# EAGLE design sharp_memory_breakout (EAGLE 6.4)
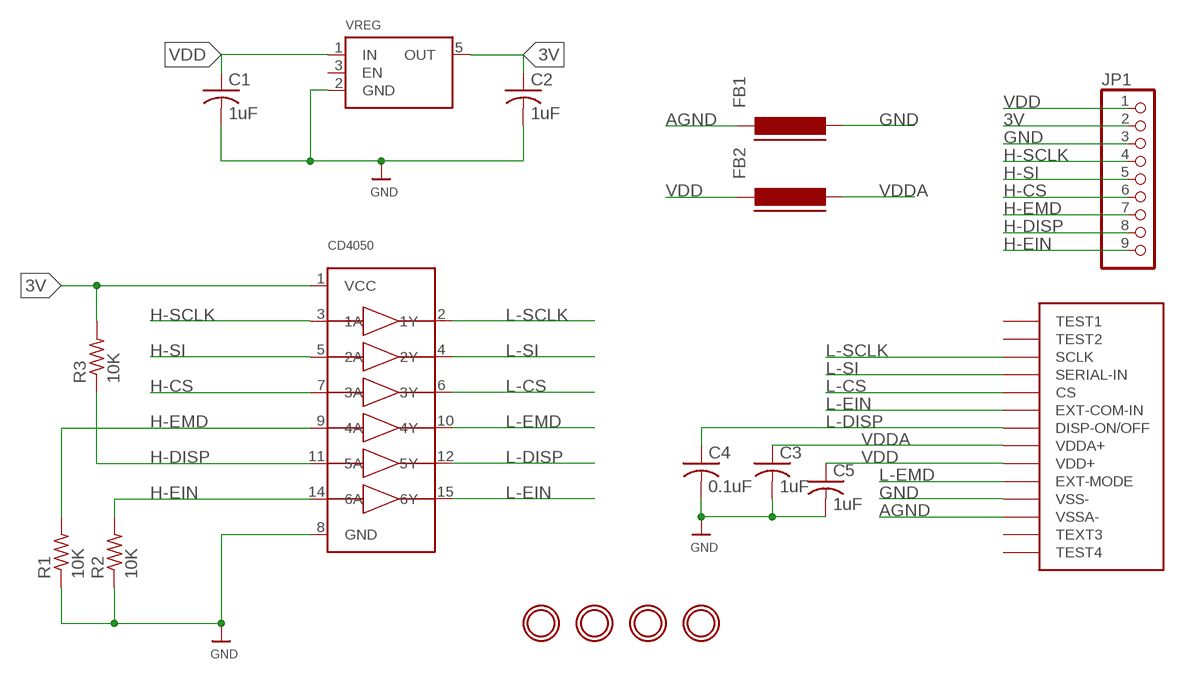
[diagram p0: schematic, sheet 1]

## Parts
C1  1uF  C-USC0805K  [C0805K]
C2  1uF  C-USC0805K  [C0805K]
C3  1uF  C-USC0805K  [C0805K]
C4  0.1uF  C-USC0805K  [C0805K]
C5  1uF  C-USC0805K  [C0805K]
CD4050  74HC4050D  [SOIC16]
FB1  FERRITE-0603  [FB603]
FB2  FERRITE-0603  [FB603]
JP1  PINHD-1X9  [1X09-BIG]
R1  10K  R-US_R0805  [R0805]
R2  10K  R-US_R0805  [R0805]
R3  10K  R-US_R0805  [R0805]
U$1  SHARP-MEMORY  [SHARP-MEMORY]
U$2  MOUNTINGHOLE3.0THIN  [MOUNTINGHOLE_3.0_PLATEDTHIN]
U$3  MOUNTINGHOLE3.0THIN  [MOUNTINGHOLE_3.0_PLATEDTHIN]
U$4  MOUNTINGHOLE3.0THIN  [MOUNTINGHOLE_3.0_PLATEDTHIN]
U$5  MOUNTINGHOLE3.0THIN  [MOUNTINGHOLE_3.0_PLATEDTHIN]
VREG  ADP121  [SOT23-5]

## Nets
3V: C2.1 CD4050.1(VCC) JP1.2 R3.2 VREG.5(OUT)
AGND: FB1.1 U$1.P$12(VSSA-)
GND: C1.2 C2.2 C3.2 C4.2 C5.2 CD4050.8(GND) FB1.2 JP1.3 R1.1 R2.1 U$1.P$11(VSS-) VREG.2(GND)
H-CS: CD4050.7(3A) JP1.6
H-DISP: CD4050.11(5A) JP1.8 R3.1
H-EIN: CD4050.14(6A) JP1.9 R2.2
H-EMD: CD4050.9(4A) JP1.7 R1.2
H-SCLK: CD4050.3(1A) JP1.4
H-SI: CD4050.5(2A) JP1.5
L-CS: CD4050.6(3Y) U$1.P$5(CS)
L-DISP: C4.1 CD4050.12(5Y) U$1.P$7(DISP-ON/OFF)
L-EIN: CD4050.15(6Y) U$1.P$6(EXT-COM-IN)
L-EMD: CD4050.10(4Y) U$1.P$10(EXT-MODE)
L-SCLK: CD4050.2(1Y) U$1.P$3(SCLK)
L-SI: CD4050.4(2Y) U$1.P$4(SERIAL-IN)
VDD: C1.1 C5.1 FB2.1 JP1.1 U$1.P$9(VDD+) VREG.1(IN)
VDDA: C3.1 FB2.2 U$1.P$8(VDDA+)
Unconnected: U$1.P$1(TEST1) U$1.P$2(TEST2) U$1.P$13(TEXT3) U$1.P$14(TEST4) VREG.3(EN)

## Library data of the parts
C1-C5 = adafruit:C-US: CAPACITOR, American symbol
CD4050 = microbuilder:74HC4050D: 6-channel level shifter 74HC4050D - 2V-6V Supply Digikey: 74HC4050D,653-ND Mouser: 771-74HC4050D-T
FB1 FB2 = dp_devices:FERRITE: Ferrite bead in various packages
JP1 = adafruit:PINHD-1X9: Pin header 1x10 0.1" spacing With round pins
R1-R3 = adafruit:R-US_: RESISTOR, American symbol
U$1 = sharp-memory:SHARP-MEMORY
U$2-U$5 = TL2575:MOUNTINGHOLE: Mounting Hole For #2 screws (0.086"/2.18mm width, 0.094"/2.4mm hole) use 2.5mm
VREG = microbuilder:ADP121: LDO Fixed Voltage Regulator 150mA The ADP121 voltage regulator is ideal for regulating battery or solar power due to it's very low foreward voltage drop (maximum 90mV at 150mA). Forward Voltage Dropout: 90mV at 150mA Input Voltage Range: 2.3V-5.5V Output Voltage Range: 1.2V-3.3V (depending on model) Digikey: 3.3V - ADP121-AUJZ33R7CT-ND Digikey: 3.0V - ADP121-AUJZ30R7CT-ND

## Board
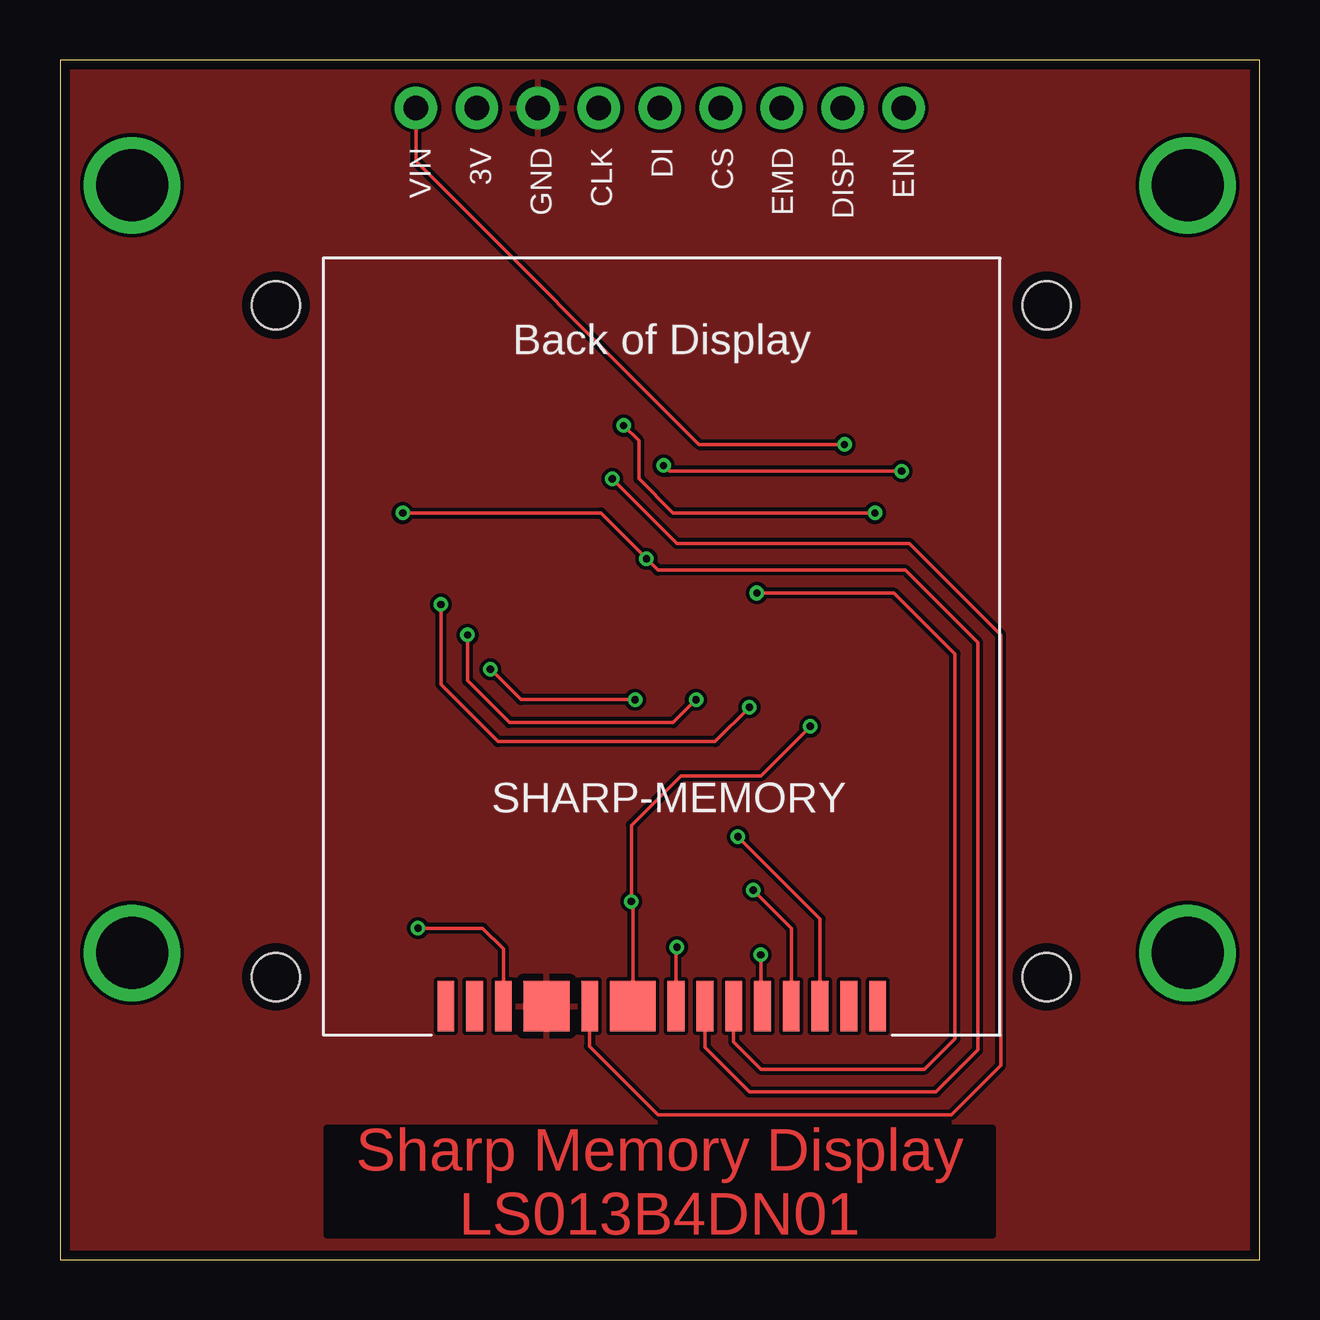
[diagram p1: board, top side]
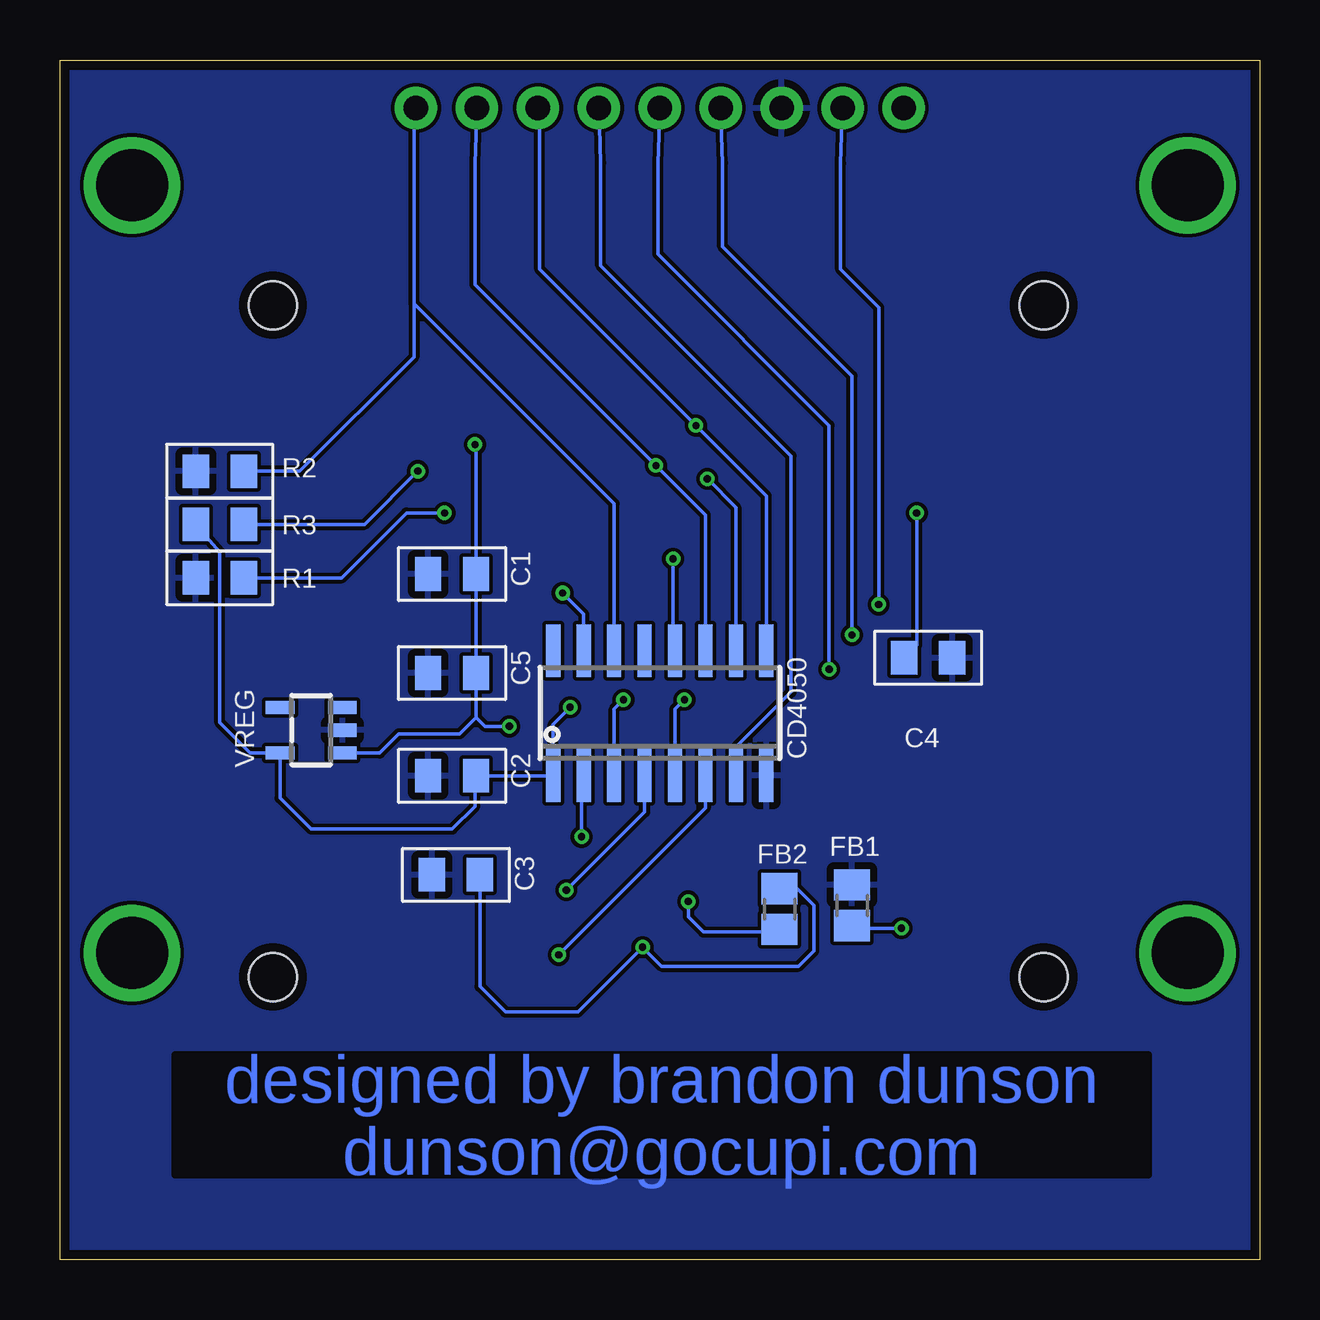
[diagram p2: board, bottom side, seen from below]

Size 50 x 50 mm. Coordinates in mm from the lower left corner, seen from the top.
Outline: 0,0 50,0 50,50 0,50 0,0
Copper layers (1*16): Top 0.035mm / dielectric 1.5mm / Bottom 0.035mm
Design rules "updated_SeeedStudio_2layer_DRU_no_angle_20140221": minimum track width 6mil, minimum drill 0.3mm, track to track 6mil, track to pad 6mil, pad to pad 6mil, via to via 6mil, smd to smd 0mil, copper to edge 0.4mm, drill to drill 6mil, minimum pad ring 10mil, minimum via ring 6mil, stop-mask expansion 2mil, vias tented up to drill 100mil, thermal gap 0.3mm
Holes 2 mm at 9,39.78 41.12,39.78 9,11.78 41.12,11.78

### Footprints (pad centres in the part's own frame; a part is rotated, then mirrored left to right if it is on the bottom)
C0805K = smd 1.1 x 1.4: 1 -1,0; 2 1,0
SOIC16 = smd 0.6 x 2.2: 1 -4.445,-2.6; 2 -3.175,-2.6; 3 -1.905,-2.6; 4 -0.635,-2.6; 5 0.635,-2.6; 6 1.905,-2.6; 7 3.175,-2.6; 8 4.445,-2.6; 9 4.445,2.6; 10 3.175,2.6; 11 1.905,2.6; 12 0.635,2.6; 13 -0.635,2.6; 14 -1.905,2.6; 15 -3.175,2.6; 16 -4.445,2.6
FB603 = smd 1.3 x 1.5: 1 -0.85,0; 2 0.85,0
1X09-BIG = drill 1.016 pad 1.778: 1 -10.16,0; 2 -7.62,0; 3 -5.08,0; 4 -2.54,0; 5 0,0; 6 2.54,0; 7 5.08,0; 8 7.62,0; 9 10.16,0
R0805 = smd 1.1 x 1.4: 1 -1,0; 2 1,0
SHARP-MEMORY = smd 0.7 x 2.1: P$1 9,-15; P$2 7.8,-15; P$3 6.6,-15; P$4 5.4,-15; P$5 4.2,-15; P$6 3,-15; P$7 1.8,-15; P$8 0.6,-15; P$10 -3,-15; P$12 -6.6,-15; P$13 -7.8,-15; P$14 -9,-15 | smd 1.9 x 2.1: P$9 -1.2,-15; P$11 -4.8,-15
MOUNTINGHOLE_3.0_PLATEDTHIN = drill 3 pad 3.6: P$1 0,0
SOT23-5 = smd 0.55 x 1.2: 1 -0.95,-1.3; 2 0,-1.3; 3 0.95,-1.3; 4 0.95,1.3; 5 -0.95,1.3

### Placement (x,y rotation side)
C1  33.66,28.57 180 bottom
C2  33.66,20.16 180 bottom
C3  33.5,16.03 180 bottom
C4  13.81,25.08 0 bottom
C5  33.66,24.45 180 bottom
CD4050  25,22.78 0 bottom
FB1  16.99,14.76 90 bottom
FB2  20,14.61 90 bottom
JP1  25,48 0 top
R1  43.34,28.42 0 bottom
R2  43.34,32.86 0 bottom
R3  43.34,30.64 180 bottom
U$1  25.08,25.56 0 top
U$2  47,12.78 0 top
U$3  3,12.78 0 top
U$4  47,44.78 0 top
U$5  3,44.78 0 top
VREG  39.53,22.07 90 bottom

### Tracks (layer width: path | path; a pad name or v marks a point on that pad's centre or on a via)
3V  (via drill 0.3)
  Top 0.152: v28.73,23.02 27.3,21.59 18.26,21.59 15.88,23.97 v15.88,27.3
  Bottom 0.152: v28.73,23.02 29.45,22.31 CD4050.1 29.46,20.16 C2.1 32.7,20.11 32.7,18.89 33.66,17.94 39.53,17.94 40.83,19.24 VREG.5 42.07,21.12 43.34,22.38 43.34,29.48 R3.2 | v15.88,27.3 15.88,39.69 17.46,41.27 17.46,45.7 JP1.2
AGND  (via drill 0.3)
  Top 0.152: U$1.P$12 18.48,12.95 17.62,13.81 v14.92,13.81
  Bottom 0.152: v14.92,13.81 16.88,13.81 FB1.1
GND
  pour Bottom: 0,0 50.01,0 50,50 0,50
  pour Top: 0,0 50.01,0 50,50 0,50
H-CS
  Bottom 0.152: CD4050.7 21.82,21.36 19.53,23.65 19.53,33.5 27.46,41.43 27.46,45.7 JP1.6
H-DISP  (via drill 0.3)
  Top 0.152: v35.08,32.86 25.4,32.86 v25.16,33.1
  Bottom 0.152: CD4050.11 23.09,31.03 v25.16,33.1 32.7,40.64 32.7,45.7 JP1.8 | R3.1 37.31,30.64 v35.08,32.86
H-EIN
  Bottom 0.152: CD4050.14 26.91,31.51 35.24,39.85 | 35.24,39.85 35.24,47.92 JP1.9 | 35.24,39.85 35.24,37.62 40.01,32.86 R2.2
H-EMD  (via drill 0.3)
  Top 0.152: v33.97,31.11 25.56,31.11 24.13,32.54 24.13,34.13 v23.5,34.77
  Bottom 0.152: CD4050.9 20.55,31.83 v23.5,34.77 23.89,35.16 30,41.27 30,47.92 JP1.7 | R1.2 38.26,28.42 35.56,31.11 v33.97,31.11
H-SCLK  (via drill 0.3)
  Top 0.152: v26.51,23.34 25.56,22.38 18.73,22.38 16.99,24.13 v16.99,26.04
  Bottom 0.152: CD4050.3 26.91,22.94 v26.51,23.34 | v16.99,26.04 16.99,36.83 22.38,42.23 22.38,45.7 JP1.4
H-SI  (via drill 0.3)
  Top 0.152: v23.97,23.34 19.21,23.34 v17.94,24.61
  Bottom 0.152: CD4050.5 24.36,22.94 v23.97,23.34 | v17.94,24.61 17.94,34.77 25.08,41.91 25.08,45.7 JP1.5
L-CS  (via drill 0.3)
  Top 0.152: v29.21,12.7 29.21,10.63 U$1.P$5
  Bottom 0.152: CD4050.6 23.09,18.82 v29.21,12.7
L-DISP  (via drill 0.3, 0.3 pad 0.15)
  Top 0.152: U$1.P$7 26.88,8.84 28.73,6.99 36.51,6.99 38.26,8.73 38.26,25.72 35.24,28.73 24.92,28.73 v24.45,29.21 22.54,31.11 v14.29,31.11
  Bottom 0.152: v24.45,29.21 24.45,25.46 CD4050.12 | C4.1 14.29,25.61 v14.29,31.11
L-EIN  (via drill 0.3)
  Top 0.152: U$1.P$6 28.08,9.06 29.21,7.94 36.04,7.94 37.31,9.21 37.31,25.24 34.77,27.78 v29.05,27.78
  Bottom 0.152: v29.05,27.78 28.18,26.91 CD4050.15
L-EMD  (via drill 0.3)
  Top 0.152: U$1.P$10 22.07,10.54 22.07,8.89 24.92,6.03 37.15,6.03 39.21,8.1 39.21,26.04 35.4,29.84 25.72,29.84 v23.02,32.54
  Bottom 0.152: v23.02,32.54 21.82,31.35 CD4050.10
L-SCLK  (via drill 0.3)
  Top 0.152: U$1.P$3 31.68,14.2 v28.26,17.62
  Bottom 0.152: v28.26,17.62 28.26,20.09 CD4050.2
L-SI  (via drill 0.3)
  Top 0.152: v28.89,15.4 30.48,13.81 U$1.P$4
  Bottom 0.152: CD4050.4 25.64,18.66 v28.89,15.4
VDD  (via drill 0.3)
  Top 0.152: U$1.P$9 23.88,14.85 v23.81,14.92 23.81,18.1 25.88,20.16 29.21,20.16 v31.27,22.23 | v32.7,33.97 26.64,33.97 14.84,45.78 JP1.1
  Bottom 0.152: v23.81,14.92 23.81,14.29 23.18,13.65 20.11,13.65 FB2.1 | 32.66,22.59 C5.1 C1.1 32.66,33.92 v32.7,33.97 | 32.66,22.59 33.34,21.91 35.88,21.91 36.67,21.11 VREG.1 | 32.66,22.59 32.29,22.23 v31.27,22.23
VDDA  (via drill 0.3)
  Top 0.152: U$1.P$8 25.68,12.98 v25.72,13.02
  Bottom 0.152: FB2.2 19.27,15.46 18.57,14.76 18.57,12.86 19.21,12.22 24.92,12.22 v25.72,13.02 28.42,10.32 31.43,10.32 32.5,11.38 C3.1

### Text on the board
Top: Sharp Memory Display / LS013B4DN01
Bottom: designed by brandon dunson / dunson@gocupi.com
tPlace: VIN / 3V / GND / CLK / DI / CS / EMD / DISP / EIN
tStop: Sharp Memory Display / LS013B4DN01